# Altium schematic sheet pd.SchDoc
size A4; SheetNumber: 7; SheetTotal: 7
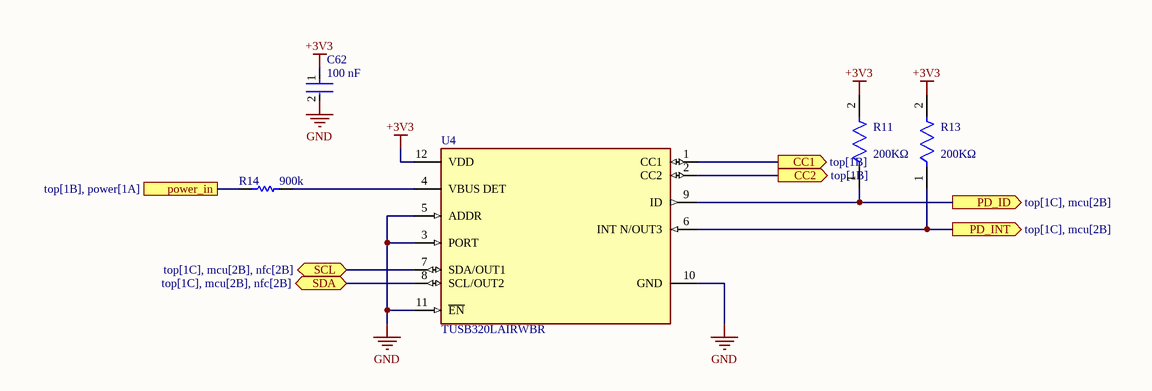
[diagram p0: pd.SchDoc]

## Parts
C62  Capacitance: 100 nF  [FP-CC0603-DA-MFG]  (hidden comment: CC0603KRX7R7BB104)
R11  value 200KΩ  [FP-RT0402-MFG]  (hidden comment: RT0402BRD07200KL)
R13  value 200KΩ  [FP-RT0402-MFG]  (hidden comment: RT0402BRD07200KL)
R14  value 900k  [RESC1005X40X25NL05T10]  (hidden comment: RC0402FR-07910KL)
U4  TUSB320LAIRWBR  [FP-RWB0012A-MFG]

## Ports
CC1 (out, see top[1B]), CC2 (out, see top[1B]), PD_ID (out, see top[1C], mcu[2B]), PD_INT (out, see top[1C], mcu[2B]), power_in (see top[1B], power[1A]), SCL (bidir, see top[1C], mcu[2B], nfc[2B]), SDA (bidir, see top[1C], mcu[2B], nfc[2B])

## Nets
+3V3: C62.1 R11.2 R13.2 U4.12(VDD)
GND: C62.2 U4.3(PORT) U4.5(ADDR) U4.10(GND) U4.11(~{EN})
CC1: U4.1(CC1) ; port CC1
CC2: U4.2(CC2) ; port CC2
PD_ID: R11.1 U4.9(ID) ; port PD_ID
PD_INT: R13.1 U4.6(INT_N/OUT3) ; port PD_INT
power_in: R14.1 ; port power_in
SCL: U4.7(SDA/OUT1) ; port SCL
SDA: U4.8(SCL/OUT2) ; port SDA
NetR14_2: R14.2 U4.4(VBUS_DET)

## Library data of the parts
C62 = CMP-2000-05002-2: CAP CER 0.1UF 16V X7R 0603; Manufacturer: YAGEO; Tolerance: 0.1; Value: 100 nF; Temperature Coefficient: 15%; Material: Ceramic; Voltage Rating: 16 V; Package: CC0603-DA; ComponentLink2Description: Datasheet; Octopart: https://octopart.com/cc0603krx7r7bb104-yageo-192941; Temperature Range High: +125°C; Digikey Description: CAP CER 0.1UF 16V X7R 0603; Voltage: 16 V; Device Class L2: Capacitors; Height: 0.9mm; Temperature: -55°C to +125°C; Manufacturer Part Number: CC0603KRX7R7BB104; Device Class L1: Passive Components; Device Class L3: Ceramic Capacitors; ComponentLink2URL: http://www.yageo.com/documents/recent/UPY-GPHC_X7R_6.3V-to-50V_18.pdf; Footprint Url: http://www.yageo.com/exep/pages/download/literatures/UPY-C_GEN_24.pdf; RoHS: TRUE; Temperature Range Low: -55°C; Temperature Characteristic: X7R; Lead Free: Yes; Category: Cap; Mouser Description: Multilayer Ceramic Capacitor, CC Series, 0.1 - F, - 10%, X7R, 16 V, 0603 [1608 Metric]; Automotive: No
R11 R13 = CMP-03412-025742-1: RES SMD 200K OHM 0.1% 1/16W 0402; Manufacturer: Yageo; Tolerance: 0.001; Voltage Rating: 50V; Description: RT0402 200KΩ 0.063W 25 ppm/°C 0.10%; Power Rating: 0.063W; Temperature Coefficient: 25 ppm/°C; Temperature: -55°C to +155°C; RoHS: TRUE; Series: RT; Resistance: 200KΩ; ComponentLink2Description: Datasheet; Manufacturer Part Number: RT0402BRD07200KL; Automotive: No; Footprint Url: http://www.yageo.com/exep/pages/download/literatures/PYu-R_Mount_10.pdf; Temperature Range Low: -55°C; Ipc Land Pattern Name: RESC10050X30; Device Class L3: Chip SMD Resistors; Category: Res; Composition: Thin Film; Digikey Description: RES SMD 200K OHM 0.1% 1/16W 0402; Temperature Range High: +155°C; Device Class L2: Resistors; Octopart: https://octopart.com/rt0402brd07200kl-yageo-71392655; Lead Free: Yes; Height: 0.35mm; ComponentLink2URL: http://www.yageo.com/documents/recent/PYu-RT_1-to-0.01_RoHS_L_9.pdf; Device Class L1: Passive Components; Package: RT0402
R14 = CMP-2002-07143-1: Manufacturer: Yageo / Phycomp; Part Number: RC0402FR-07910KL
U4 = CMP-04877-000014-1: IC USB TYPE-C LOGIC/PORT 12X2QFN; RoHS Compliant: Yes; Max Operating Temperature: 85°C; Lead Free: Lead Free; Mount: Surface Mount; Packaging: Tape and Reel; Min Operating Temperature: -40°C; Number of Pins: 12